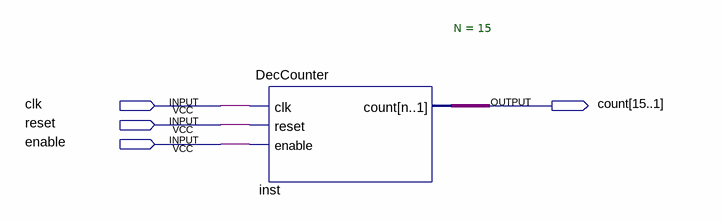
[diagram p0: schematic sheet]
// Quartus schematic Block2.bdf as structural Verilog: 1 symbols, 4 pins
module Block2 (
  input  clk,
  input  reset,
  input  enable,
  output [15:1] count
);

  DecCounter #(.N(15)) inst (.clk(clk), .reset(reset), .enable(enable), .count(count));
endmodule
